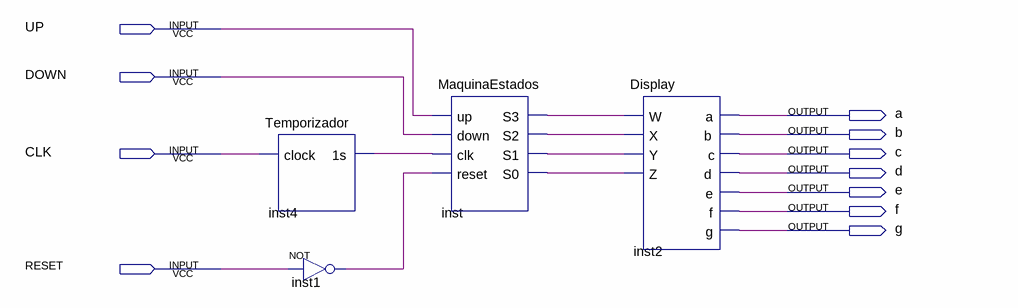
[diagram p0: schematic sheet]
// Quartus schematic CircuitoPrincipal.bdf as structural Verilog: 4 symbols, 11 pins
module CircuitoPrincipal (
  input  UP,
  input  DOWN,
  input  CLK,
  input  RESET,
  output a,
  output b,
  output c,
  output d,
  output e,
  output f,
  output g
);

  wire inst1_out, inst4_1s, inst_s0, inst_s1, inst_s2, inst_s3;

  Temporizador inst4 (.clock(CLK), .\1s (inst4_1s));
  not inst1 (inst1_out, RESET);
  MaquinaEstados inst (
    .up(UP), .down(DOWN), .clk(inst4_1s), .reset(inst1_out), .S3(inst_s3), .S2(inst_s2), .S1(inst_s1),
    .S0(inst_s0));
  Display inst2 (.W(inst_s3), .X(inst_s2), .Y(inst_s1), .Z(inst_s0), .a(a), .b(b), .c(c), .d(d), .e(e), .f(f), .g(g));
endmodule
